# Altium project main_project.PrjPcb
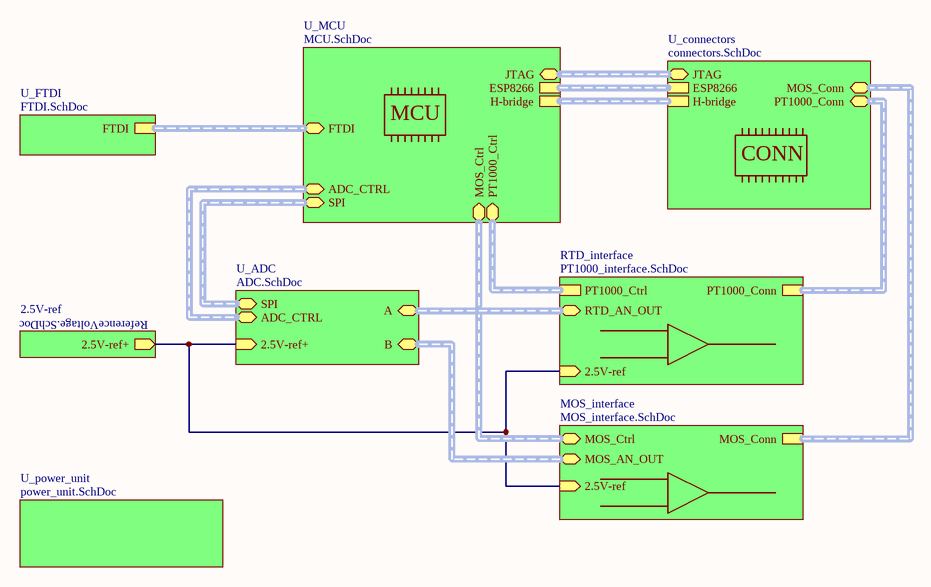
[diagram p0: Main.SchDoc]
9 sheets, 126 parts. Net scope: hierarchical (ports join the sheet entries above them; power ports are global).
Board files: main_fv.PcbDoc, PCB2.PcbDoc
Sheets:
  Main.SchDoc
    U_connectors = connectors.SchDoc
    U_MCU = MCU.SchDoc
    MOS_interface = MOS_interface.SchDoc
    RTD_interface = PT1000_interface.SchDoc
    U_power_unit = power_unit.SchDoc
    U_FTDI = FTDI.SchDoc
    U_ADC = ADC.SchDoc
    2.5V-ref = ReferenceVoltage.SchDoc

## Sheet Main.SchDoc: Top level scheme of Total Ionizing Dose meter (TIDm)
size A4; Date: 30.05.2015; Author: G. Gajoch, M. Gumiela; DocumentNumber: 1; SheetNumber: 1; SheetTotal: 9; Model: EM1; PageSetup: Record=PageOptions|CenterHorizontal=True|CenterVertical=True|PrintScale=0.52|XCorrection=1.00|YCorrection=1.00|PrintKind=1|BorderSize=5000000|LeftOffset=0|BottomOffset=0|Orientation=2|PaperLength=4200|PaperWidth=2970|Scale=100|PaperSource=7|PrintQuality=600|MediaType=1|DitherType=10|PaperKind=A3|PrintScaleMode=1

### Sub-sheets
2.5V-ref = ReferenceVoltage.SchDoc: 2.5V-ref+ (out)
MOS_interface = MOS_interface.SchDoc: MOS_Conn (harness MUX_Conn), MOS_AN_OUT (harness ADC_IN), 2.5V-ref (in), MOS_Ctrl (harness MUX_Ctrl)
RTD_interface = PT1000_interface.SchDoc: PT1000_Ctrl (harness MUX_Ctrl), PT1000_Conn (harness MUX_Conn), 2.5V-ref (in), RTD_AN_OUT (harness ADC_IN)
U_ADC = ADC.SchDoc: A (harness ADC_IN), B (harness ADC_IN), ADC_CTRL (harness ADC_CTRL), 2.5V-ref+ (in), SPI (harness SPI)
U_connectors = connectors.SchDoc: ESP8266 (harness ESP8266), H-bridge (harness H-Bridge), PT1000_Conn (harness MUX_Conn), MOS_Conn (harness MUX_Conn), JTAG (harness JTAG)
U_FTDI = FTDI.SchDoc: FTDI (harness FTDI)
U_MCU = MCU.SchDoc: ESP8266 (harness ESP8266), H-bridge (harness H-Bridge), JTAG (harness JTAG), FTDI (harness FTDI), ADC_CTRL (harness ADC_CTRL), SPI (harness SPI), PT1000_Ctrl (harness MUX_Ctrl), MOS_Ctrl
U_power_unit = power_unit.SchDoc: no entries

### Nets
2.5V-ref: sheet MOS_interface/2.5V-ref, sheet RTD_interface/2.5V-ref, sheet U_ADC/2.5V-ref+, sheet 2.5V-ref/2.5V-ref+

### Buses and harness runs
harness sheet MOS_interface/MOS_AN_OUT = sheet U_ADC/B
harness sheet MOS_interface/MOS_Conn = sheet U_connectors/MOS_Conn
harness sheet MOS_interface/MOS_Ctrl = sheet U_MCU/MOS_Ctrl
harness sheet RTD_interface/PT1000_Conn = sheet U_connectors/PT1000_Conn
harness sheet RTD_interface/PT1000_Ctrl = sheet U_MCU/PT1000_Ctrl
harness sheet RTD_interface/RTD_AN_OUT = sheet U_ADC/A
harness sheet U_ADC/ADC_CTRL = sheet U_MCU/ADC_CTRL
harness sheet U_ADC/SPI = sheet U_MCU/SPI
harness sheet U_connectors/ESP8266 = sheet U_MCU/ESP8266
harness sheet U_connectors/H-bridge = sheet U_MCU/H-bridge
harness sheet U_connectors/JTAG = sheet U_MCU/JTAG
harness sheet U_FTDI/FTDI = sheet U_MCU/FTDI

### Notes on the sheet
- MCU
- CONN
- Title:
- Sheet:
- of
- Author:
- Model:
- Document Number:
- Checked by:
- Iss-Rev:
- Approved by:
- Date:
- File name:

## Sheet connectors.SchDoc: Connectors
size A4; Date: 30.05.2015; Author: Michał Gumiela; DocumentNumber: 8; SheetNumber: 8; SheetTotal: 9; Model: EM1; PageSetup: Record=PageOptions|CenterHorizontal=True|CenterVertical=True|PrintScale=0.52|XCorrection=1.00|YCorrection=1.00|PrintKind=1|BorderSize=5000000|LeftOffset=0|BottomOffset=0|Orientation=2|PaperLength=4200|PaperWidth=2970|Scale=100|PaperSource=7|PrintQuality=600|MediaType=1|DitherType=10|PaperKind=A3|PrintScaleMode=1
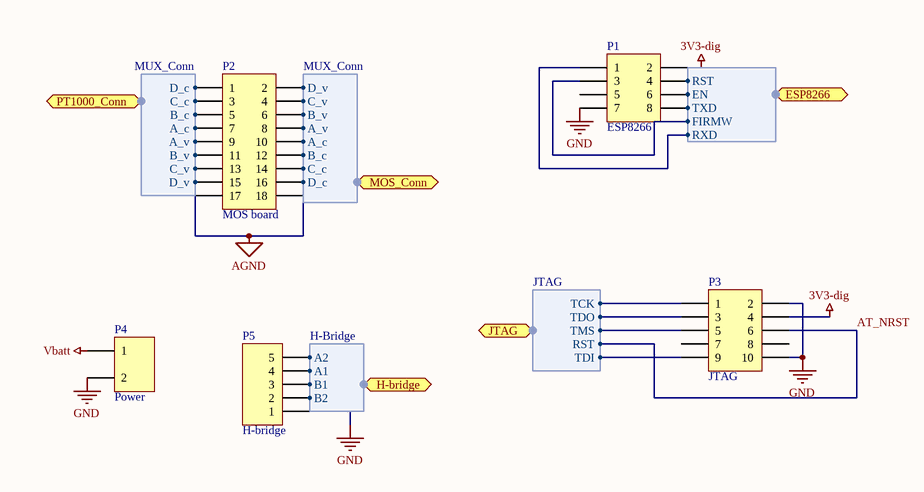
[diagram p1: connectors.SchDoc]

### Parts
P1  ESP8266  [Header 2x4]
P2  MOS board  [Header 2x9]
P3  JTAG  [Header 2x5]
P4  Power  [Header 1x3]
P5  H-bridge  [Header 1x5]

### Ports
ESP8266 (harness ESP8266), H-bridge (harness H-Bridge), JTAG (harness JTAG), MOS_Conn (harness MUX_Conn), PT1000_Conn (harness MUX_Conn)

### Harnesses
ESP8266: TXD, RXD, EN, RST, FIRMW
H-Bridge: A1, A2, B1, B2
MUX_Conn: A_c, B_c, C_c, D_c, A_v, B_v, C_v, D_v
JTAG: TCK, TMS, TDO, TDI, RST

### Nets
3V3-dig: P1.2 P3.4
AGND: P2.17 P2.18
GND: P1.7 P3.2 P3.10 P4.3(2) P5.1
Vbatt: P4.1
AT_NRST: P3.6 ; port JTAG.RST
NetP1_1: P1.1 ; port ESP8266.RXD
NetP1_3: P1.3 ; port ESP8266.FIRMW
NetP1_4: P1.4 ; port ESP8266.RST
NetP1_6: P1.6 ; port ESP8266.EN
NetP1_8: P1.8 ; port ESP8266.TXD
NetP2_1: P2.1 ; port PT1000_Conn.D_c
NetP2_2: P2.2 ; port MOS_Conn.D_v
NetP2_3: P2.3 ; port PT1000_Conn.C_c
NetP2_4: P2.4 ; port MOS_Conn.C_v
NetP2_5: P2.5 ; port PT1000_Conn.B_c
NetP2_6: P2.6 ; port MOS_Conn.B_v
NetP2_7: P2.7 ; port PT1000_Conn.A_c
NetP2_8: P2.8 ; port MOS_Conn.A_v
NetP2_9: P2.9 ; port PT1000_Conn.A_v
NetP2_10: P2.10 ; port MOS_Conn.A_c
NetP2_11: P2.11 ; port PT1000_Conn.B_v
NetP2_12: P2.12 ; port MOS_Conn.B_c
NetP2_13: P2.13 ; port PT1000_Conn.C_v
NetP2_14: P2.14 ; port MOS_Conn.C_c
NetP2_15: P2.15 ; port PT1000_Conn.D_v
NetP2_16: P2.16 ; port MOS_Conn.D_c
NetP3_1: P3.1 ; port JTAG.TCK
NetP3_3: P3.3 ; port JTAG.TDO
NetP3_5: P3.5 ; port JTAG.TMS
NetP3_9: P3.9 ; port JTAG.TDI
NetP5_2: P5.2 ; port H-bridge.B2
NetP5_3: P5.3 ; port H-bridge.B1
NetP5_4: P5.4 ; port H-bridge.A1
NetP5_5: P5.5 ; port H-bridge.A2

Not connected (* = marked no-connect by the designer): P1 5; P3 7 8; P4 2

### Notes on the sheet
- Title:
- Sheet:
- of
- Author:
- Model:
- Document Number:
- Checked by:
- Iss-Rev:
- Approved by:
- Date:
- File name:

### Library data of the parts
P1 = Header 4X2: Header, 4-Pin, Dual row; LatestRevisionDate: 17-Jul-2002; LatestRevisionNote: Re-released for DXP Platform.; Publisher: Altium Limited
P2 = Header 9X2: Header, 9-Pin, Dual row; LatestRevisionDate: 17-Jul-2002; LatestRevisionNote: Re-released for DXP Platform.; Publisher: Altium Limited
P3 = Header 5X2: Header, 5-Pin, Dual row; LatestRevisionDate: 17-Jul-2002; LatestRevisionNote: Re-released for DXP Platform.; Publisher: Altium Limited
P4 = Header 3: Header, 3-Pin; LatestRevisionDate: 17-Jul-2002; LatestRevisionNote: Re-released for DXP Platform.; Publisher: Altium Limited
P5 = Header 5: Header, 5-Pin; LatestRevisionDate: 17-Jul-2002; LatestRevisionNote: Re-released for DXP Platform.; Publisher: Altium Limited

## Sheet MCU.SchDoc: MCU board
size A4; Date: 30.05.2015; Author: Grzegorz Gajoch; Engineer: Grzegorz Gajoch; DocumentNumber: 4; SheetNumber: 4; SheetTotal: 9; Model: EM1; PageSetup: Record=PageOptions|CenterHorizontal=True|CenterVertical=True|PrintScale=0.52|XCorrection=1.00|YCorrection=1.00|PrintKind=1|BorderSize=5000000|LeftOffset=0|BottomOffset=0|Orientation=2|PaperLength=4200|PaperWidth=2970|Scale=100|PaperSource=7|PrintQuality=600|MediaType=1|DitherType=10|PaperKind=A3|PrintScaleMode=1
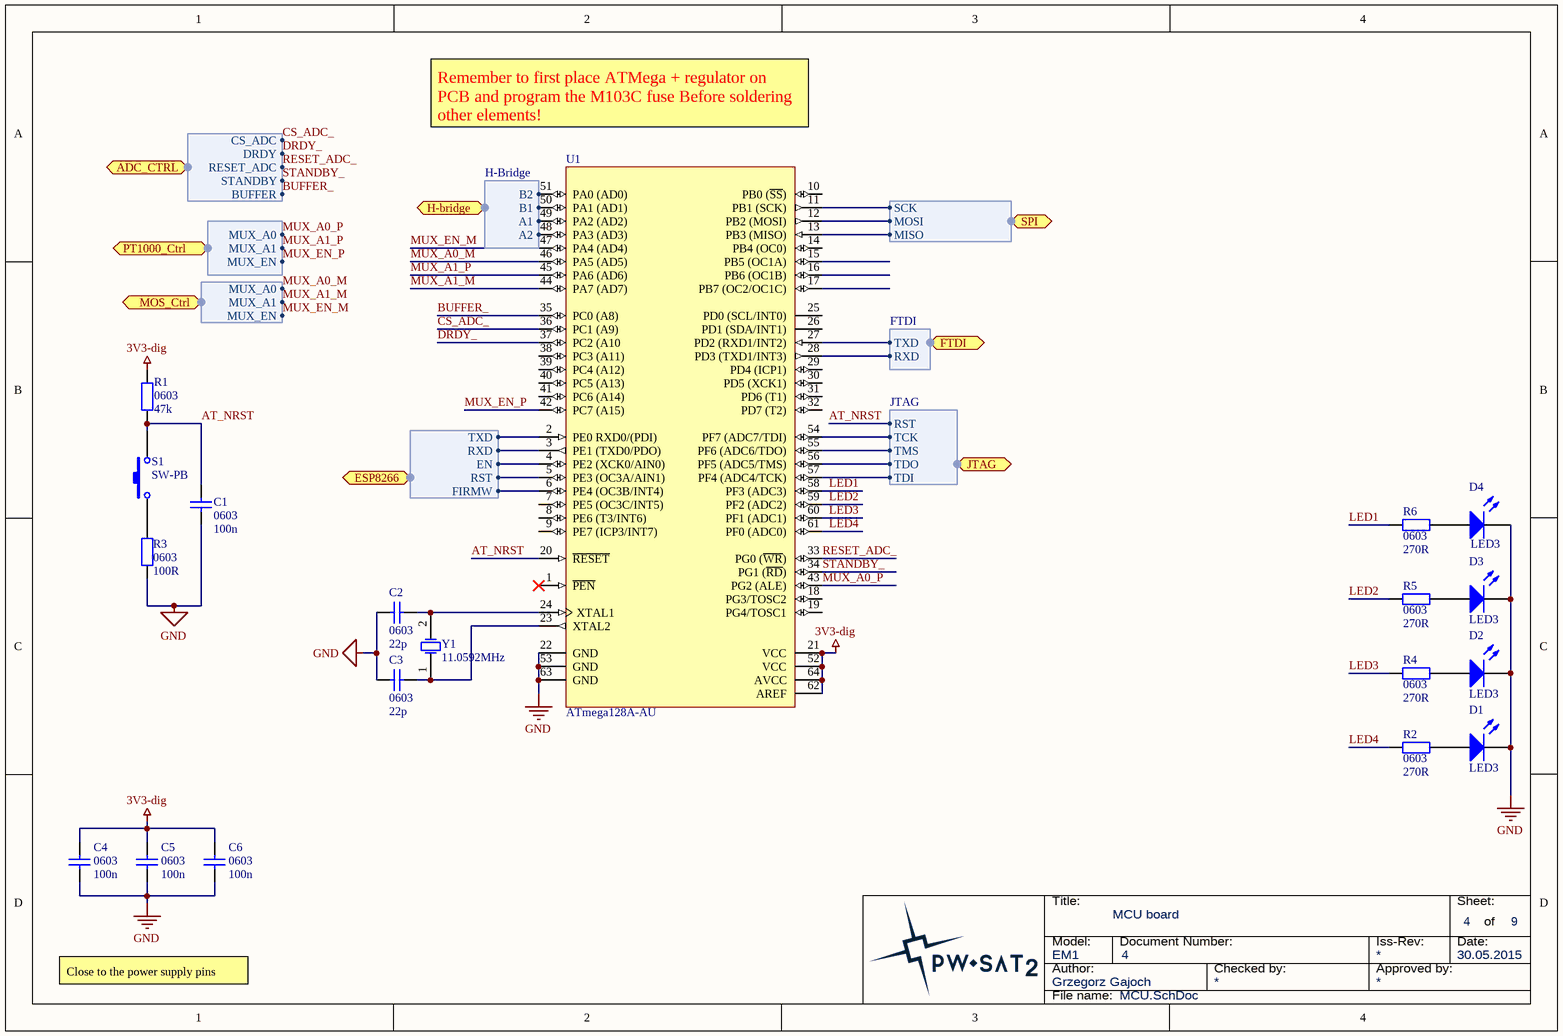
[diagram p2: MCU.SchDoc]

### Parts
C1  0603  value 100n  [SMD_Capacitor_0603]
C2  0603  value 22p  [SMD_Capacitor_0603]
C3  0603  value 22p  [SMD_Capacitor_0603]
C4  0603  value 100n  [SMD_Capacitor_0603]
C5  0603  value 100n  [SMD_Capacitor_0603]
C6  0603  value 100n  [SMD_Capacitor_0603]
D1  LED3  [LED 0805 RED]
D2  LED3  [LED 0805 GREEN]
D3  LED3  [LED 0805 Yellow]
D4  LED3  [LED 0805 Blue]
R1  0603  value 47k  [SMD_Resistor_0603]
R2  0603  value 270R  [SMD_Resistor_0603]
R3  0603  value 100R  [SMD_Resistor_0603]
R4  0603  value 270R  [SMD_Resistor_0603]
R5  0603  value 270R  [SMD_Resistor_0603]
R6  0603  value 270R  [SMD_Resistor_0603]
S1  SW-PB  [Tact Switch 3x6]
U1  ATmega128A-AU  [64A_M]
Y1  11.0592MHz  [Quartz]

### Ports
ADC_CTRL (harness ADC_CTRL), ESP8266 (harness ESP8266), FTDI (harness FTDI), H-bridge (harness H-Bridge), JTAG (harness JTAG), MOS_Ctrl (harness MUX_Ctrl), PT1000_Ctrl (harness MUX_Ctrl), SPI (harness SPI)

### Harnesses
JTAG: TCK, TMS, TDO, TDI, RST
MUX_Ctrl: MUX_A0, MUX_A1, MUX_EN
SPI: SCK, MOSI, MISO
FTDI: RXD, TXD
ADC_CTRL: CS_ADC, DRDY, RESET_ADC, STANDBY, BUFFER
ESP8266: TXD, RXD, EN, RST, FIRMW
H-Bridge: A1, A2, B1, B2

### Nets
3V3-dig: C4.2 C5.2 C6.2 R1.2 U1.21(VCC) U1.52(VCC) U1.62(AREF) U1.64(AVCC)
GND: C1.1 C2.1 C3.1 C4.1 C5.1 C6.1 D1.2(K) D2.2(K) D3.2(K) D4.2(K) R3.2 U1.22(GND) U1.53(GND) U1.63(GND)
AT_NRST: C1.2 R1.1 S1.2 U1.20(~{RESET}) ; port JTAG.RST
BUFFER_: U1.35(PC0_(A8)) ; port ADC_CTRL.BUFFER
CS_ADC_: U1.36(PC1_(A9)) ; port ADC_CTRL.CS_ADC
DRDY_: U1.37(PC2_(A10) ; port ADC_CTRL.DRDY
FTDI_RXD: U1.28(PD3_(TXD1/INT3)) ; port FTDI.RXD
FTDI_TXD: U1.27(PD2_(RXD1/INT2)) ; port FTDI.TXD
LED1: R6.2 U1.58(PF3_(ADC3))
LED2: R5.2 U1.59(PF2_(ADC2))
LED3: R4.2 U1.60(PF1_(ADC1))
LED4: R2.2 U1.61(PF0_(ADC0))
MUX_A0_M: U1.46(PA5_(AD5)) ; port MOS_Ctrl.MUX_A0
MUX_A0_P: U1.43(PG2_(ALE)) ; port PT1000_Ctrl.MUX_A0
MUX_A1_M: U1.44(PA7_(AD7)) ; port MOS_Ctrl.MUX_A1
MUX_A1_P: U1.45(PA6_(AD6)) ; port PT1000_Ctrl.MUX_A1
MUX_EN_M: U1.47(PA4_(AD4)) ; port MOS_Ctrl.MUX_EN
MUX_EN_P: U1.42(PC7_(A15)) ; port PT1000_Ctrl.MUX_EN
RESET_ADC_: U1.33(PG0_(~{WR})) ; port ADC_CTRL.RESET_ADC
STANDBY_: U1.34(PG1_(~{RD})) ; port ADC_CTRL.STANDBY
NetC2_2: C2.2 U1.24(XTAL1) Y1.2(OSC2)
NetC3_2: C3.2 U1.23(XTAL2) Y1.1(OSC1)
NetD1_1: D1.1(A) R2.1
NetD2_1: D2.1(A) R4.1
NetD3_1: D3.1(A) R5.1
NetD4_1: D4.1(A) R6.1
NetP1_1: U1.3(PE1_(TXD0/PDO)) ; port ESP8266.RXD
NetP1_3: U1.6(PE4_(OC3B/INT4)) ; port ESP8266.FIRMW
NetP1_4: U1.5(PE3_(OC3A/AIN1)) ; port ESP8266.RST
NetP1_6: U1.4(PE2_(XCK0/AIN0)) ; port ESP8266.EN
NetP1_8: U1.2(PE0_RXD0/(PDI)) ; port ESP8266.TXD
NetP3_1: U1.54(PF7_(ADC7/TDI)) ; port JTAG.TCK
NetP3_3: U1.56(PF5_(ADC5/TMS)) ; port JTAG.TDO
NetP3_5: U1.55(PF6_(ADC6/TDO)) ; port JTAG.TMS
NetP3_9: U1.57(PF4_(ADC4/TCK)) ; port JTAG.TDI
NetP5_2: U1.51(PA0_(AD0)) ; port H-bridge.B2
NetP5_3: U1.50(PA1_(AD1)) ; port H-bridge.B1
NetP5_4: U1.49(PA2_(AD2)) ; port H-bridge.A1
NetP5_5: U1.48(PA3_(AD3)) ; port H-bridge.A2
NetR3_1: R3.1 S1.1
NetU1_11: U1.11(PB1_(SCK)) ; port SPI.SCK
NetU1_12: U1.12(PB2_(MOSI)) ; port SPI.MOSI
NetU1_13: U1.13(PB3_(MISO)) ; port SPI.MISO

Not connected (* = marked no-connect by the designer): U1 1(~{PEN})* 7(PE5_(OC3C/INT5)) 8(PE6_(T3/INT6)) 9(PE7_(ICP3/INT7)) 10(PB0_(~{SS})) 14(PB4_(OC0)) 15(PB5_(OC1A)) 16(PB6_(OC1B)) 17(PB7_(OC2/OC1C)) 18(PG3/TOSC2) 19(PG4/TOSC1) 25(PD0_(SCL/INT0)) 26(PD1_(SDA/INT1)) 29(PD4_(ICP1)) 30(PD5_(XCK1)) 31(PD6_(T1)) 32(PD7_(T2)) 38(PC3_(A11)) 39(PC4_(A12)) 40(PC5_(A13)) 41(PC6_(A14))

### Notes on the sheet
- Remember to first place ATMega + regulator on PCB and program the M103C fuse Before soldering other elements!
- Close to the power supply pins
- Title:
- Sheet:
- of
- Author:
- Model:
- Document Number:
- Checked by:
- Iss-Rev:
- Approved by:
- Date:
- File name:

### Library data of the parts
C1 C4-C6 = Cap: Capacitor; Published: 8-Jun-2000; LatestRevisionDate: 17-Jul-2002; LatestRevisionNote: Re-released for DXP Platform.; PackageReference: RAD-0.3; Publisher: Altium Limited; PackageDescription: Radial Cap, Thru-Hole; 2 Leads; 0.3 in Pin Spacing
C2 C3 = Cap1: Capacitor; Published: 8-Jun-2000; LatestRevisionDate: 17-Jul-2002; LatestRevisionNote: Re-released for DXP Platform.; PackageReference: RAD-0.3; Publisher: Altium Limited; PackageDescription: Radial Cap, Thru-Hole; 2 Leads; 0.3 in Pin Spacing
D1-D4 = LED3: Typical BLUE SiC LED; Published: 8-Jun-2000; LatestRevisionDate: 17-Dec-2003; LatestRevisionNote: PCB Footprint replaced.; DatasheetVersion: 16-Apr-2002; PackageVersion: 16-Apr-2002; PackageReference: 3.5X2.8X1.9; Publisher: Altium Limited; PackageDescription: SM LED; 2 C-Bend Leads; Body 3.5 x 2.8 x 1.9 mm, inc leads (LxWxH typ)
R1-R6 = Res2: Resistor; Published: 8-Jun-2000; LatestRevisionDate: 17-Jul-2002; LatestRevisionNote: Re-released for DXP Platform.; PackageReference: AXIAL-0.4; Publisher: Altium Limited; PackageDescription: Axial Device, Thru-Hole; 2 Leads; 0.4 in Pin Spacing
S1 = SW-PB: Switch; Published: 24-Mar-1999; LatestRevisionDate: 17-Jul-2002; LatestRevisionNote: Re-released for DXP Platform.; PackageReference: SPST-2; Publisher: Altium Limited; PackageDescription: Switch; 2 Leads
U1 = ATmega128A-AU: 8-bit AVR Microcontroller, 2.7-5.5V, 16MHz, 128KB Flash, 4KB EEPROM, 4KB SRAM, 64-pin TQFP, Industrial Grade (-40°C to 85°C); DatasheetVersion: revH, Feb-2011; PackageVersion: revC, Oct-2010; PackageReference: 64A; PackageDescription: 64-Pin Plastic Thin Profile Quad Flat Pack, 14 x 14 x 1.0 mm Body, 0.8 mm Pitch (TQFP); Code_JEDEC: MS-026-AEB; ComponentLink1Description: Manufacturer URL; ComponentLink1URL: http://www.atmel.com/; ComponentLink2Description: ATmega128A Datasheet; ComponentLink2URL: http://www.atmel.com/dyn/resources/prod_documents/doc8151.pdf; ComponentLink3Description: ATmega128A Summary; ComponentLink3URL: http://www.atmel.com/dyn/resources/prod_documents/8151S.pdf
Y1 = XTAL: LF XTAL003519; Published: 8-Jun-2000; LatestRevisionDate: 17-Jul-2002; LatestRevisionNote: Re-released for DXP Platform.; PackageReference: R38; Publisher: Altium Limited; PackageDescription: Crystal, Thru-Hole; 2 Leads; Body 3.1 x 8.2 mm (Dia.xH)

## Sheet MOS_interface.SchDoc: P-MOSFET analog interface
size A3; Date: 30.05.2015; Author: Michał Gumiela; DocumentNumber: 6; SheetNumber: 6; SheetTotal: 9; Model: EM1; PageSetup: Record=PageOptions|CenterHorizontal=True|CenterVertical=True|PrintScale=0.52|XCorrection=1.00|YCorrection=1.00|PrintKind=1|BorderSize=5000000|LeftOffset=0|BottomOffset=0|Orientation=2|PaperLength=4200|PaperWidth=2970|Scale=100|PaperSource=7|PrintQuality=600|MediaType=1|DitherType=10|PaperKind=A3|PrintScaleMode=1
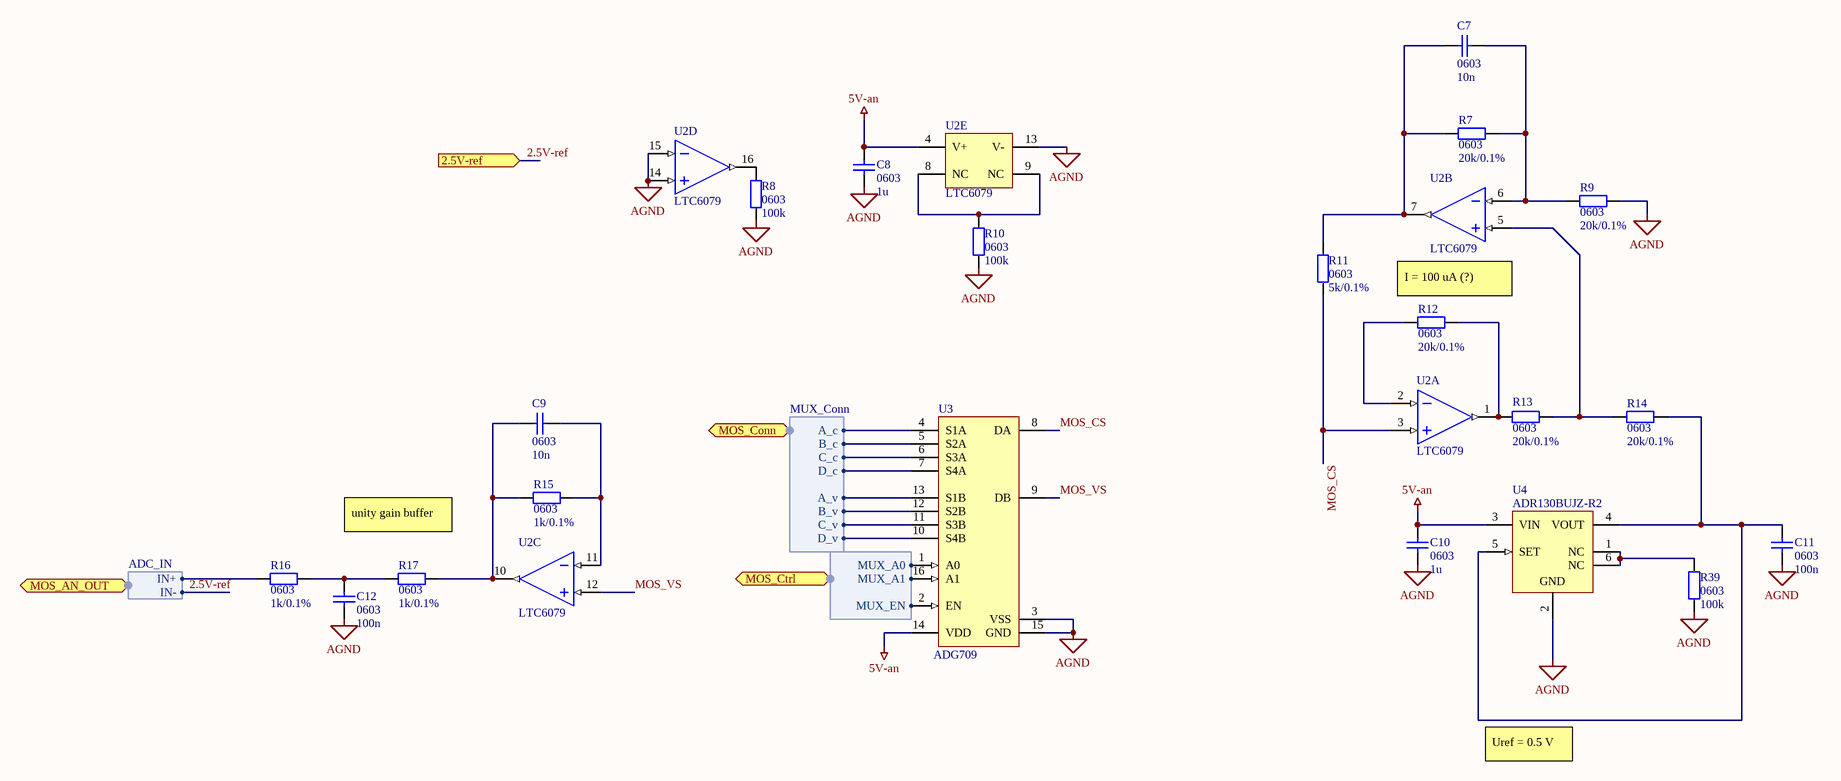
[diagram p3: MOS_interface.SchDoc]

### Parts
C7  0603  value 10n  [SMD_Capacitor_0603]
C8  0603  value 1u  [SMD_Capacitor_0603]
C9  0603  value 10n  [SMD_Capacitor_0603]
C10  0603  value 1u  [SMD_Capacitor_0603]
C11  0603  value 100n  [SMD_Capacitor_0603]
C12  0603  value 100n  [SMD_Capacitor_0603]
R7  0603  value 20k/0.1%  [SMD_Resistor_0603]
R8  0603  value 100k  [SMD_Resistor_0603]
R9  0603  value 20k/0.1%  [SMD_Resistor_0603]
R10  0603  value 100k  [SMD_Resistor_0603]
R11  0603  value 5k/0.1%  [SMD_Resistor_0603]
R12  0603  value 20k/0.1%  [SMD_Resistor_0603]
R13  0603  value 20k/0.1%  [SMD_Resistor_0603]
R14  0603  value 20k/0.1%  [SMD_Resistor_0603]
R15  0603  value 1k/0.1%  [SMD_Resistor_0603]
R16  0603  value 1k/0.1%  [SMD_Resistor_0603]
R17  0603  value 1k/0.1%  [SMD_Resistor_0603]
R39  0603  value 100k  [SMD_Resistor_0603]
U2  LTC6079  [SSOP-16]  (parts A,B,C,D,E of 5)
U3  ADG709  [TSSOP16]
U4  ADR130BUJZ-R2  [ADI-UJ-6_M]

### Ports
2.5V-ref (in), MOS_AN_OUT (harness ADC_IN), MOS_Conn (harness MUX_Conn), MOS_Ctrl (harness MUX_Ctrl)

### Harnesses
MUX_Ctrl: MUX_A0, MUX_A1, MUX_EN
MUX_Conn: A_c, B_c, C_c, D_c, A_v, B_v, C_v, D_v
ADC_IN: IN+, IN-

### Nets
5V-an: C8.2 C10.2 U2.4(V+) U3.14(VDD) U4.3(VIN)
AGND: C8.1 C10.1 C11.1 C12.1 R8.1 R9.1 R10.1 R39.1 U2.13(V-) U2.14(IN+_D) U2.15(IN-_D) U3.3(VSS) U3.15(GND) U4.2(GND)
2.5V-ref: port 2.5V-ref, port MOS_AN_OUT.IN-
MOS_CS: R11.1 U2.3(IN+_A) U3.8(DA)
MOS_VS: U2.12(IN+_C) U3.9(DB)
MUX_A0_M: U3.1(A0) ; port MOS_Ctrl.MUX_A0
MUX_A1_M: U3.16(A1) ; port MOS_Ctrl.MUX_A1
MUX_EN_M: U3.2(EN) ; port MOS_Ctrl.MUX_EN
NetC7_1: C7.1 R7.1 R9.2 U2.6(IN-_B)
NetC7_2: C7.2 R7.2 R11.2 U2.7(OUT_B)
NetC9_1: C9.1 R15.2 U2.11(IN-_C)
NetC9_2: C9.2 R15.1 R17.2 U2.10(OUT_C)
NetC11_2: C11.2 R14.1 U4.4(VOUT) U4.5(SET)
NetC12_2: C12.2 R16.2 R17.1
NetP2_2: U3.10(S4B) ; port MOS_Conn.D_v
NetP2_4: U3.11(S3B) ; port MOS_Conn.C_v
NetP2_6: U3.12(S2B) ; port MOS_Conn.B_v
NetP2_8: U3.13(S1B) ; port MOS_Conn.A_v
NetP2_10: U3.4(S1A) ; port MOS_Conn.A_c
NetP2_12: U3.5(S2A) ; port MOS_Conn.B_c
NetP2_14: U3.6(S3A) ; port MOS_Conn.C_c
NetP2_16: U3.7(S4A) ; port MOS_Conn.D_c
NetR8_2: R8.2 U2.16(OUT_D)
NetR10_2: R10.2 U2.8(NC) U2.9(NC)
NetR12_1: R12.1 R13.2 U2.1(OUT_A)
NetR12_2: R12.2 U2.2(IN-_A)
NetR13_1: R13.1 R14.2 U2.5(IN+_B)
NetR16_1: R16.1 ; port MOS_AN_OUT.IN+
NetR39_2: R39.2 U4.1(NC) U4.6(NC)

### Notes on the sheet
- I = 100 uA (?)
- unity gain buffer
- Uref = 0.5 V
- Title:
- Sheet:
- of
- Author:
- Model:
- Document Number:
- Checked by:
- Iss-Rev:
- Approved by:
- Date:
- File name:

### Library data of the parts
C7-C12 = Cap: Capacitor; Published: 8-Jun-2000; LatestRevisionDate: 17-Jul-2002; LatestRevisionNote: Re-released for DXP Platform.; PackageReference: RAD-0.3; Publisher: Altium Limited; PackageDescription: Radial Cap, Thru-Hole; 2 Leads; 0.3 in Pin Spacing
R7-R17 R39 = Res2: Resistor; Published: 8-Jun-2000; LatestRevisionDate: 17-Jul-2002; LatestRevisionNote: Re-released for DXP Platform.; PackageReference: AXIAL-0.4; Publisher: Altium Limited; PackageDescription: Axial Device, Thru-Hole; 2 Leads; 0.4 in Pin Spacing
U2 = LTC6079: Rail-to-rail, quad operational amplifier. Library compatible with LTC608X LTC607X op-amps; Manufacturer: Linear Technology; Value: LTC6079
U3 = ADG709: CMOS Analog 4-Channel Multiplexer; Manufacturer: Analog Devices; ManufacturerPartNumber: ADG709
U4 = ADR130BUJZ-R2: Precision Series Sub-Band Gap Voltage Reference, 1 V Output, 2 to 18 V Supply, Industrial, 6-pin SOT23 (UJ-6), Reel; Manufacturer: Analog Devices; Max V Supply (V): 18; Min V Supply (V): 2; Ref Out TC (ppm/C): 5; Vout: 0.5V, 1V; DatasheetVersion: Rev. B; PackageVersion: Dec-04; PackageReference: UJ-6; PackageDescription: 6-Pin Thin Small Outline Transistor Package, Body 2.9 x 1.6 mm, Pitch 0.95 mm; Supplier 1: Digi-Key; Supplier Part Number 1: ADR130BUJZ-R2TR-ND; Supplier 2: Digi-Key; Supplier Part Number 2: ADR130BUJZ-R2CT-ND; Supplier 3: Digi-Key; Supplier Part Number 3: ADR130BUJZ-R2DKR-ND; Supplier 4: Farnell; Supplier Part Number 4: 1699555; Supplier 5: Mouser; Supplier Part Number 5: 584-ADR130BUJZ-R2; Packing: Reel; Operating Temp Range: -40 to 125 degC; Mounting Technology: Surface Mount; Code_JEDEC: MO-193-AA; PartNumber: ADR130BUJZ-R2; ComponentLink1Description: Manufacturer URL; ComponentLink1URL: http://www.analog.com/en/index.html; ComponentLink2Description: Datasheet; ComponentLink2URL: http://www.analog.com/static/imported-files/data_sheets/ADR130.pdf; ComponentLink3Description: Package Specification; ComponentLink3URL: http://www.analog.com/static/imported-files/packages/PKG_PDF/TSOT(UJ)/UJ_6.pdf; ComponentLink4Description: URL Link1; ComponentLink4URL: Product URL:http://www.analog.com/en/special-linear-functions/voltage-references/adr130/products/product.html

## Sheet PT1000_interface.SchDoc: RTD analog interface
size A3; Date: 30.05.2015; Author: Michał Gumiela; DocumentNumber: 5; SheetNumber: 5; SheetTotal: 9; Model: EM1; PageSetup: Record=PageOptions|CenterHorizontal=True|CenterVertical=True|PrintScale=0.52|XCorrection=1.00|YCorrection=1.00|PrintKind=1|BorderSize=5000000|LeftOffset=0|BottomOffset=0|Orientation=2|PaperLength=4200|PaperWidth=2970|Scale=100|PaperSource=7|PrintQuality=600|MediaType=1|DitherType=10|PaperKind=A3|PrintScaleMode=1
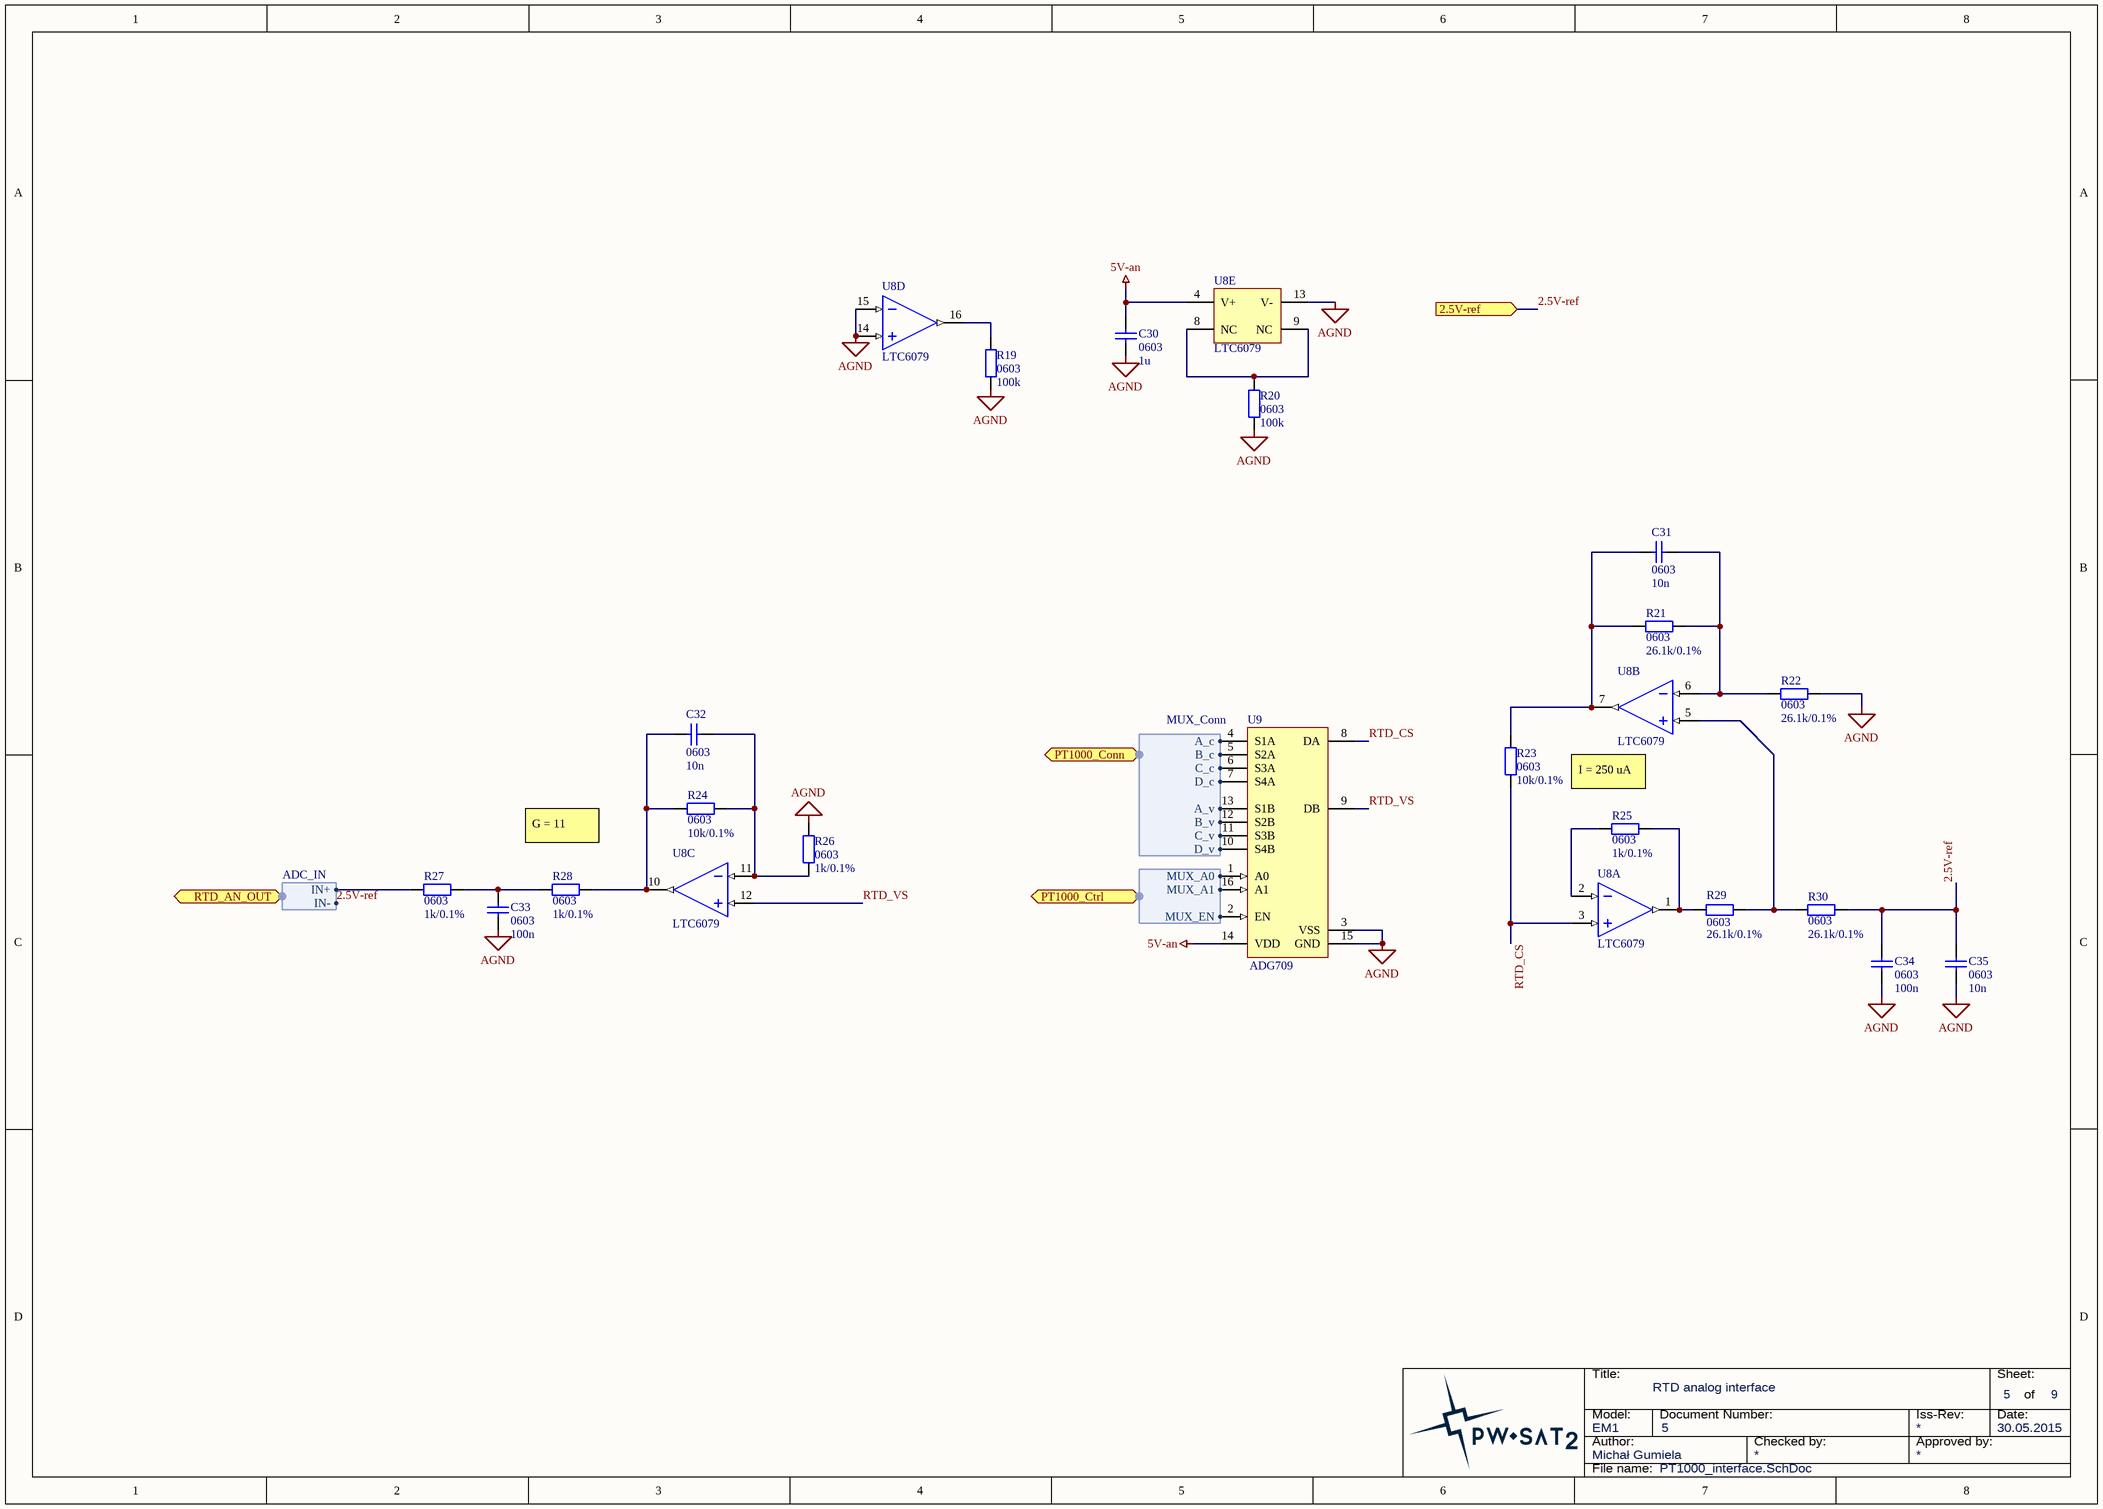
[diagram p4: PT1000_interface.SchDoc]

### Parts
C30  0603  value 1u  [SMD_Capacitor_0603]
C31  0603  value 10n  [SMD_Capacitor_0603]
C32  0603  value 10n  [SMD_Capacitor_0603]
C33  0603  value 100n  [SMD_Capacitor_0603]
C34  0603  value 100n  [SMD_Capacitor_0603]
C35  0603  value 10n  [SMD_Capacitor_0603]
R19  0603  value 100k  [SMD_Resistor_0603]
R20  0603  value 100k  [SMD_Resistor_0603]
R21  0603  value 26.1k/0.1%  [SMD_Resistor_0603]
R22  0603  value 26.1k/0.1%  [SMD_Resistor_0603]
R23  0603  value 10k/0.1%  [SMD_Resistor_0603]
R24  0603  value 10k/0.1%  [SMD_Resistor_0603]
R25  0603  value 1k/0.1%  [SMD_Resistor_0603]
R26  0603  value 1k/0.1%  [SMD_Resistor_0603]
R27  0603  value 1k/0.1%  [SMD_Resistor_0603]
R28  0603  value 1k/0.1%  [SMD_Resistor_0603]
R29  0603  value 26.1k/0.1%  [SMD_Resistor_0603]
R30  0603  value 26.1k/0.1%  [SMD_Resistor_0603]
U8  LTC6079  [SSOP-16]  (parts A,B,C,D,E of 5)
U9  ADG709  [TSSOP16]

### Ports
2.5V-ref (in), PT1000_Conn (harness MUX_Conn), PT1000_Ctrl (harness MUX_Ctrl), RTD_AN_OUT (harness ADC_IN)

### Harnesses
MUX_Ctrl: MUX_A0, MUX_A1, MUX_EN
MUX_Conn: A_c, B_c, C_c, D_c, A_v, B_v, C_v, D_v
ADC_IN: IN+, IN-

### Nets
5V-an: C30.2 U8.4(V+) U9.14(VDD)
AGND: C30.1 C33.1 C34.1 C35.1 R19.1 R20.1 R22.1 R26.1 U8.13(V-) U8.14(IN+_D) U8.15(IN-_D) U9.3(VSS) U9.15(GND)
2.5V-ref: C34.2 C35.2 R30.1 ; port 2.5V-ref, port RTD_AN_OUT.IN-
MUX_A0_P: U9.1(A0) ; port PT1000_Ctrl.MUX_A0
MUX_A1_P: U9.16(A1) ; port PT1000_Ctrl.MUX_A1
MUX_EN_P: U9.2(EN) ; port PT1000_Ctrl.MUX_EN
RTD_CS: R23.1 U8.3(IN+_A) U9.8(DA)
RTD_VS: U8.12(IN+_C) U9.9(DB)
NetC31_1: C31.1 R21.1 R22.2 U8.6(IN-_B)
NetC31_2: C31.2 R21.2 R23.2 U8.7(OUT_B)
NetC32_1: C32.1 R24.1 R26.2 U8.11(IN-_C)
NetC32_2: C32.2 R24.2 R28.2 U8.10(OUT_C)
NetC33_2: C33.2 R27.2 R28.1
NetP2_1: U9.7(S4A) ; port PT1000_Conn.D_c
NetP2_3: U9.6(S3A) ; port PT1000_Conn.C_c
NetP2_5: U9.5(S2A) ; port PT1000_Conn.B_c
NetP2_7: U9.4(S1A) ; port PT1000_Conn.A_c
NetP2_9: U9.13(S1B) ; port PT1000_Conn.A_v
NetP2_11: U9.12(S2B) ; port PT1000_Conn.B_v
NetP2_13: U9.11(S3B) ; port PT1000_Conn.C_v
NetP2_15: U9.10(S4B) ; port PT1000_Conn.D_v
NetR19_2: R19.2 U8.16(OUT_D)
NetR20_2: R20.2 U8.8(NC) U8.9(NC)
NetR25_1: R25.1 U8.2(IN-_A)
NetR25_2: R25.2 R29.2 U8.1(OUT_A)
NetR27_1: R27.1 ; port RTD_AN_OUT.IN+
NetR29_1: R29.1 R30.2 U8.5(IN+_B)

### Notes on the sheet
- I = 250 uA
- G = 11
- Title:
- Sheet:
- of
- Author:
- Model:
- Document Number:
- Checked by:
- Iss-Rev:
- Approved by:
- Date:
- File name:

### Library data of the parts
C30-C35 = Cap: Capacitor; Published: 8-Jun-2000; LatestRevisionDate: 17-Jul-2002; LatestRevisionNote: Re-released for DXP Platform.; PackageReference: RAD-0.3; Publisher: Altium Limited; PackageDescription: Radial Cap, Thru-Hole; 2 Leads; 0.3 in Pin Spacing
R19-R30 = Res2: Resistor; Published: 8-Jun-2000; LatestRevisionDate: 17-Jul-2002; LatestRevisionNote: Re-released for DXP Platform.; PackageReference: AXIAL-0.4; Publisher: Altium Limited; PackageDescription: Axial Device, Thru-Hole; 2 Leads; 0.4 in Pin Spacing
U8 = LTC6079: as U2 on sheet MOS_interface; Value: LTC6079
U9 = ADG709: as U3 on sheet MOS_interface; ManufacturerPartNumber: ADG709

## Sheet power_unit.SchDoc: Power filtering circuit
size A4; Date: 30.05.2015; Author: Grzegorz Gajoch; DocumentNumber: 2; SheetNumber: 2; SheetTotal: 9; Model: EM1; PageSetup: Record=PageOptions|CenterHorizontal=True|CenterVertical=True|PrintScale=0.52|XCorrection=1.00|YCorrection=1.00|PrintKind=1|BorderSize=5000000|LeftOffset=0|BottomOffset=0|Orientation=2|PaperLength=4200|PaperWidth=2970|Scale=100|PaperSource=7|PrintQuality=600|MediaType=1|DitherType=10|PaperKind=A3|PrintScaleMode=1
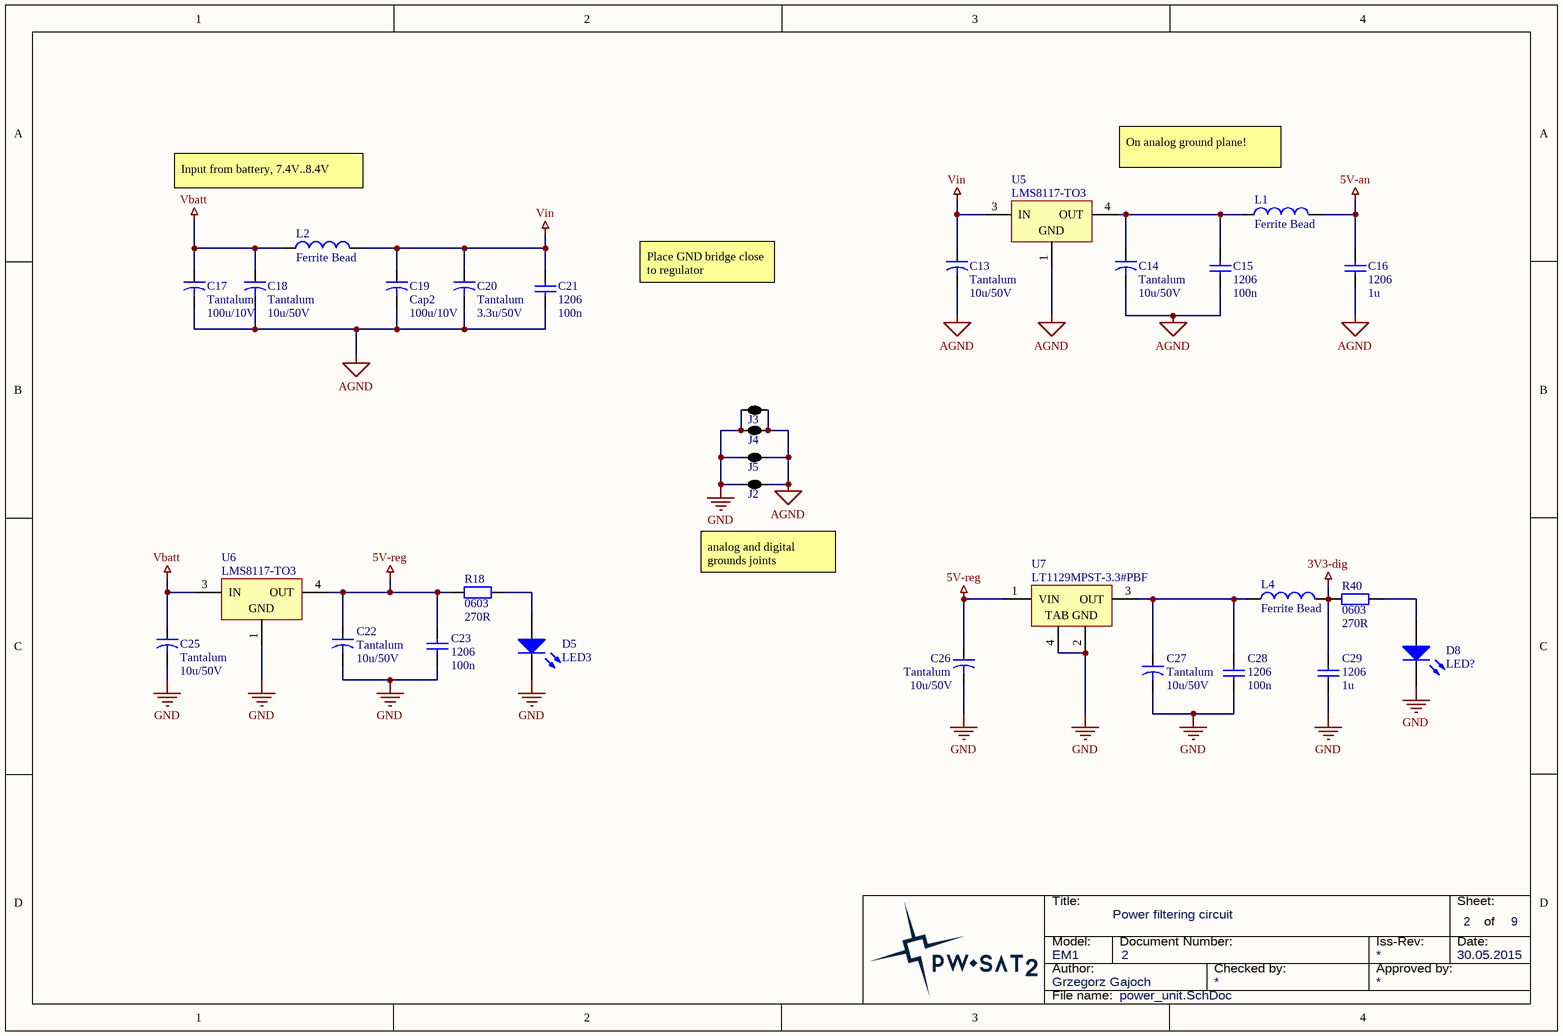
[diagram p5: power_unit.SchDoc]

### Parts
C13  Tantalum  value 10u/50V  [Tantalum_cap_D]
C14  Tantalum  value 10u/50V  [Tantalum_cap_D]
C15  1206  value 100n  [SMD_Capacitor_1206]
C16  1206  value 1u  [SMD_Capacitor_1206]
C17  Tantalum  value 100u/10V  [Tantalum_cap_D]
C18  Tantalum  value 10u/50V  [Tantalum_cap_D]
C19  Cap2  value 100u/10V  [Tantalum_cap_D]
C20  Tantalum  value 3.3u/50V  [Tantalum_cap_D]
C21  1206  value 100n  [SMD_Capacitor_1206]
C22  Tantalum  value 10u/50V  [Tantalum_cap_D]
C23  1206  value 100n  [SMD_Capacitor_1206]
C25  Tantalum  value 10u/50V  [Tantalum_cap_D]
C26  Tantalum  value 10u/50V  [Tantalum_cap_D]
C27  Tantalum  value 10u/50V  [Tantalum_cap_D]
C28  1206  value 100n  [SMD_Capacitor_1206]
C29  1206  value 1u  [SMD_Capacitor_1206]
D5  LED3  [LED 0805 RED]
D8  LED?  [LED 0805 RED]
J2  2 way net tie junction  [2way_MP]  (value not drawn)  (net tie, no BOM)
J3  2 way net tie junction  [2way_MP]  (value not drawn)  (net tie, no BOM)
J4  2 way net tie junction  [2way_MP]  (value not drawn)  (net tie, no BOM)
J5  2 way net tie junction  [2way_MP]  (value not drawn)  (net tie, no BOM)
L1  Ferrite Bead  [Ferrite 1206]
L2  Ferrite Bead  [Ferrite 1206]
L4  Ferrite Bead  [Ferrite 1206]
R18  0603  value 270R  [SMD_Resistor_0603]
R40  0603  value 270R  [SMD_Resistor_0603]
U5  LMS8117-TO3  [TD03B_M]
U6  LMS8117-TO3  [TD03B_M]
U7  LT1129MPST-3.3#PBF  [LT-ST-3-SOT-223_N]

### Nets
3V3-dig: C29.2 L4.2 R40.2
5V-an: C16.2 L1.2
5V-reg: C22.1 C23.2 C26.1 R18.2 U6.4(OUT) U7.1(VIN)
AGND: C13.2 C14.2 C15.1 C16.1 C17.2 C18.2 C19.2 C20.2 C21.1 J2.2 J3.2 J4.2 J5.2 U5.1(GND)
GND: C22.2 C23.1 C25.2 C26.2 C27.2 C28.1 C29.1 D5.2(K) D8.2(K) J2.1 J3.1 J4.1 J5.1 U6.1(GND) U7.2(GND) U7.4(TAB)
Vbatt: C17.1 C18.1 C25.1 L2.1 U6.3(IN)
Vin: C13.1 C19.1 C20.1 C21.2 L2.2 U5.3(IN)
NetC14_1: C14.1 C15.2 L1.1 U5.4(OUT)
NetC27_1: C27.1 C28.2 L4.1 U7.3(OUT)
NetD5_1: D5.1(A) R18.1
NetD8_1: D8.1(A) R40.1

### Notes on the sheet
- On analog ground plane!
- Input from battery, 7.4V..8.4V
- Place GND bridge close to regulator
- analog and digital grounds joints
- Title:
- Sheet:
- of
- Author:
- Model:
- Document Number:
- Checked by:
- Iss-Rev:
- Approved by:
- Date:
- File name:

### Library data of the parts
C13 C14 C17-C20 C22 C25-C27 = Cap2: Capacitor; Published: 23-Sep-2002; PackageReference: CAPR5-4X5; Publisher: Altium Limited; PackageDescription: Capacitor; 2 Leads
C15 C16 C21 C23 C28 C29 = Cap: Capacitor; Published: 8-Jun-2000; LatestRevisionDate: 17-Jul-2002; LatestRevisionNote: Re-released for DXP Platform.; PackageReference: RAD-0.3; Publisher: Altium Limited; PackageDescription: Radial Cap, Thru-Hole; 2 Leads; 0.3 in Pin Spacing
D5 D8 = LED3: Typical BLUE SiC LED; Published: 8-Jun-2000; LatestRevisionDate: 17-Dec-2003; LatestRevisionNote: PCB Footprint replaced.; DatasheetVersion: 16-Apr-2002; PackageVersion: 16-Apr-2002; PackageReference: 3.5X2.8X1.9; Publisher: Altium Limited; PackageDescription: SM LED; 2 C-Bend Leads; Body 3.5 x 2.8 x 1.9 mm, inc leads (LxWxH typ)
J2-J5 = 2way: ComponentLink1URL: http://www.edatools.cz/addons; ComponentLink1Description: Source; FootprintNote: LP=12mil, MP=40mil, HP=120mil
L1 L2 L4 = Inductor: Code_IEC: 1005; Published: 8-Jun-2000; LatestRevisionDate: 29-May-2009; LatestRevisionNote: IPC-7351 Footprint Added.; PackageReference: 0402-A; Publisher: Altium Limited; PackageDescription: Chip Inductor; Code_JEITA: 0402
R18 R40 = Res2: Resistor; Published: 8-Jun-2000; LatestRevisionDate: 17-Jul-2002; LatestRevisionNote: Re-released for DXP Platform.; PackageReference: AXIAL-0.4; Publisher: Altium Limited; PackageDescription: Axial Device, Thru-Hole; 2 Leads; 0.4 in Pin Spacing
U7 = LT1129MPST-3.3#PBF: Micropower Low Dropout Regulator with Shutdown, 4.15 to 30 V Vin, 3.3 V Vout, 3-pin SOT223 (ST-3), -55 to 125 degC, Pb-Free; Manufacturer: Linear Technology; Discrete Pass Element: no; Dropout Voltage(V): 0.45; Iout(mA): 700; Isupply(mA): 0.05; Number of Outputs: 1; Output Voltage: 3.3 V; PSRR(dB): 64; Shutdown Current(uA): 16; Vin Max(V): 30; Vin Min(V): 4.15; DatasheetVersion: Rev. F; PackageVersion: Jun-10; PackageReference: ST-3; PackageDescription: 3-Pin Plastic SOT-223, 3.505 x 6.505 mm Body, Pitch 2.3 mm; Supplier 1: Digi-Key; Supplier Part Number 1: LT1129MPST-3.3#PBF-ND; RoHS: TRUE; Mounting Technology: Surface Mount; PartNumber: LT1129MPST-3.3#PBF; ComponentLink1Description: Manufacturer URL; ComponentLink1URL: http://www.linear.com/; ComponentLink2Description: Datasheet; ComponentLink2URL: http://cds.linear.com/docs/en/datasheet/112935ff.pdf; ComponentLink3Description: Package Specification; ComponentLink3URL: http://cds.linear.com/docs/en/packaging/SOT_3_05-08-1630.pdf

## Sheet FTDI.SchDoc: FTDI
size A4; Date: 30.05.2015; Author: G. Gajoch, M. Gumiela; DocumentNumber: 9; SheetNumber: 9; SheetTotal: 9; Model: EM1; PageSetup: Record=PageOptions|CenterHorizontal=True|CenterVertical=True|PrintScale=0.52|XCorrection=1.00|YCorrection=1.00|PrintKind=1|BorderSize=5000000|LeftOffset=0|BottomOffset=0|Orientation=2|PaperLength=4200|PaperWidth=2970|Scale=100|PaperSource=7|PrintQuality=600|MediaType=1|DitherType=10|PaperKind=A3|PrintScaleMode=1
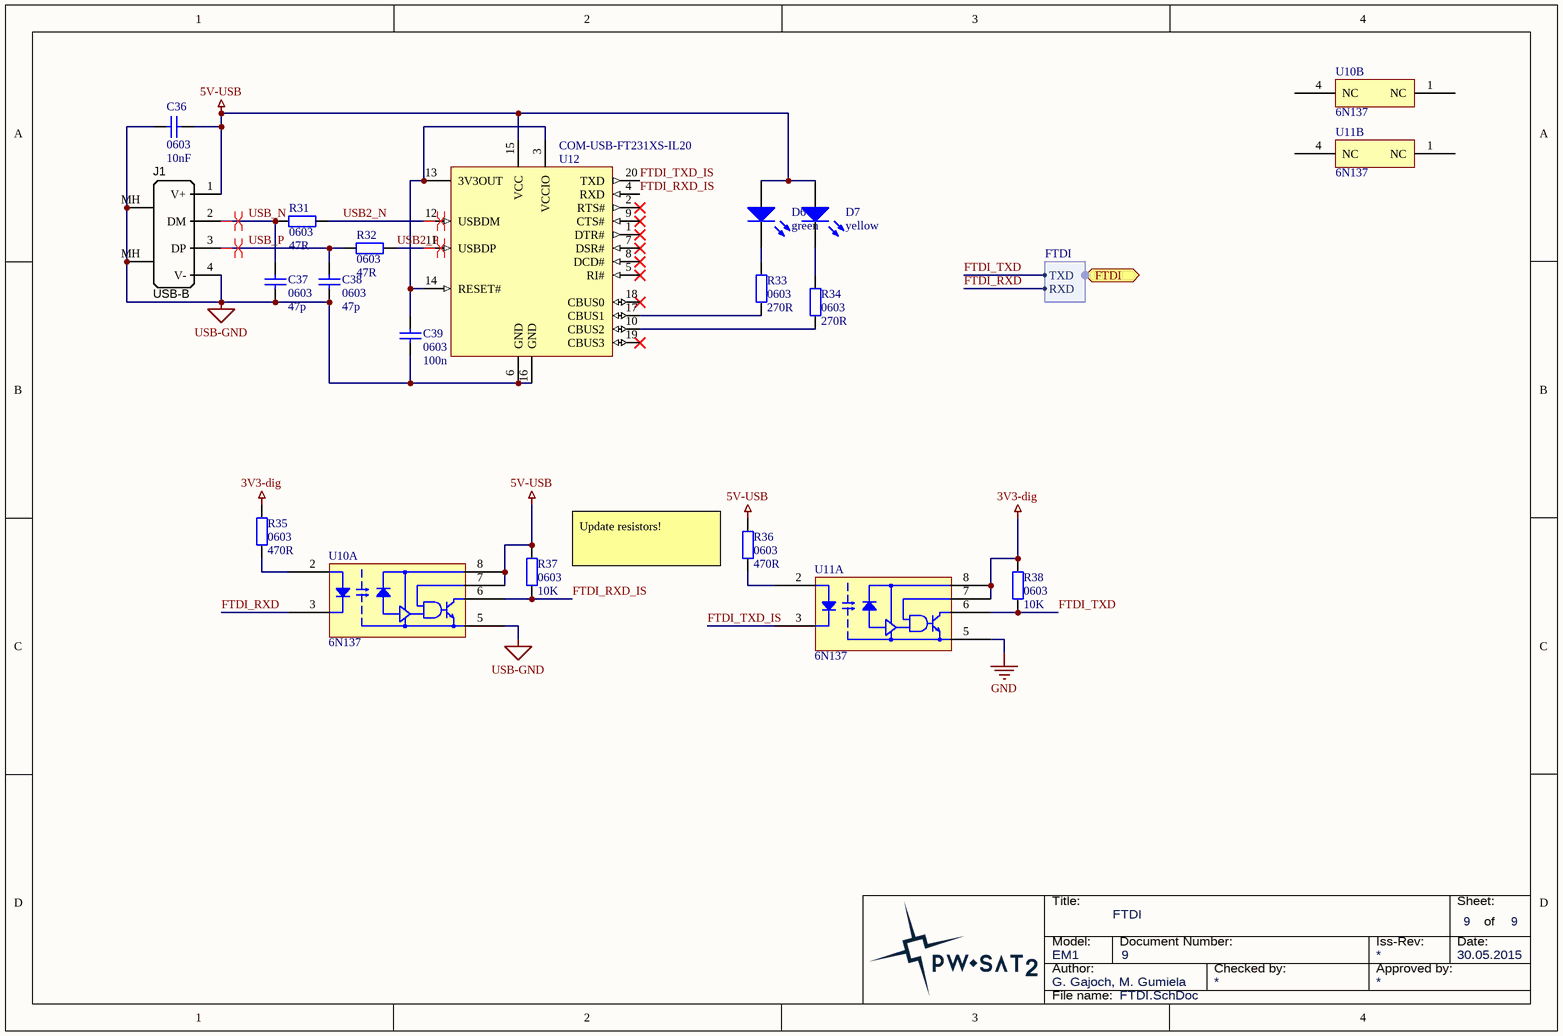
[diagram p6: FTDI.SchDoc]

### Parts
C36  0603  value 10nF  [SMD_Capacitor_0603]
C37  0603  value 47p  [SMD_Capacitor_0603]
C38  0603  value 47p  [SMD_Capacitor_0603]
C39  0603  value 100n  [SMD_Capacitor_0603]
D6  green  [LED 0805 GREEN]
D7  yellow  [LED 0805 Yellow]
J1  USB-B  [USB_TypeB_Tyco]
R31  0603  value 47R  [SMD_Resistor_0603]
R32  0603  value 47R  [SMD_Resistor_0603]
R33  0603  value 270R  [SMD_Resistor_0603]
R34  0603  value 270R  [SMD_Resistor_0603]
R35  0603  value 470R  [SMD_Resistor_0603]
R36  0603  value 470R  [SMD_Resistor_0603]
R37  0603  value 10K  [SMD_Resistor_0603]
R38  0603  value 10K  [SMD_Resistor_0603]
U10  6N137  [Surface Mount DIP 8-pin]  (parts A,B of 2)
U11  6N137  [Surface Mount DIP 8-pin]  (parts A,B of 2)
U12  COM-USB-FT231XS-IL20  [SSOP-20_L]

### Ports
FTDI (harness FTDI)

### Harnesses
FTDI: RXD, TXD

### Nets
3V3-dig: R35.2 R38.2 U11.7(Ve) U11.8(Vcc)
5V-USB: C36.1 D6.1(A) D7.1(A) J1.1(V+) R36.2 R37.2 U10.7(Ve) U10.8(Vcc) U12.15(VCC)
GND: U11.5(GND)
USB-GND: C36.2 C37.1 C38.1 C39.1 J1.4(V-) J1.MH(Shell) U10.5(GND) U12.6(GND) U12.16(GND)
FTDI_RXD: U10.3(-) ; port FTDI.RXD
FTDI_RXD_IS: R37.1 U10.6(Vo) U12.4(RXD)
FTDI_TXD: R38.1 U11.6(Vo) ; port FTDI.TXD
FTDI_TXD_IS: U11.3(-) U12.20(TXD)
USB2_N: R31.2 U12.12(USBDM)
USB2_P: R32.2 U12.11(USBDP)
USB_N: C37.2 J1.2(DM) R31.1
USB_P: C38.2 J1.3(DP) R32.1
NetC39_2: C39.2 U12.3(VCCIO) U12.13(3V3OUT) U12.14(RESET#)
NetD6_2: D6.2(K) R33.2
NetD7_2: D7.2(K) R34.2
NetR33_1: R33.1 U12.17(CBUS1)
NetR34_1: R34.1 U12.10(CBUS2)
NetR35_1: R35.1 U10.2(+)
NetR36_1: R36.1 U11.2(+)

Not connected (* = marked no-connect by the designer): U10 1(NC) 4(NC); U11 1(NC) 4(NC); U12 1(DTR#)* 2(RTS#)* 5(RI#)* 7(DSR#)* 8(DCD#)* 9(CTS#)* 18(CBUS0)* 19(CBUS3)*

### Layout directives
differential pair: USB2_N, USB2_P, USB_N, USB_P

### Notes on the sheet
- Update resistors!
- Title:
- Sheet:
- of
- Author:
- Model:
- Document Number:
- Checked by:
- Iss-Rev:
- Approved by:
- Date:
- File name:

### Library data of the parts
C36-C39 = Cap: Capacitor; Published: 8-Jun-2000; LatestRevisionDate: 17-Jul-2002; LatestRevisionNote: Re-released for DXP Platform.; PackageReference: RAD-0.3; Publisher: Altium Limited; PackageDescription: Radial Cap, Thru-Hole; 2 Leads; 0.3 in Pin Spacing
D6 D7 = LED2: Typical RED, GREEN, YELLOW, AMBER GaAs LED; Published: 8-Jun-2000; LatestRevisionDate: 17-Jul-2002; LatestRevisionNote: Re-released for DXP Platform.; PackageVersion: Feb-2002; PackageReference: 3.2X1.6X1.1; Publisher: Altium Limited; PackageDescription: SM LED; 2 Flat Leads
J1 = USB_TypeB: Connector THT Type B USB connector; Manufacturer Part Number 1: 292304-1; Manufacturer 1: TE Connectivity; Specifications: USB 2.0; SCDType: undef; Package / Case: R/A Type B; Supplier 1: Digi-Key; Connector Type: USB - B; Supplier Part Number 1: A31725-ND
R31-R38 = Res2: Resistor; Published: 8-Jun-2000; LatestRevisionDate: 17-Jul-2002; LatestRevisionNote: Re-released for DXP Platform.; PackageReference: AXIAL-0.4; Publisher: Altium Limited; PackageDescription: Axial Device, Thru-Hole; 2 Leads; 0.4 in Pin Spacing

## Sheet ADC.SchDoc: 24-bit Analog to Digital converter
size A4; Date: 30.05.2015; Author: Grzegorz Gajoch; DocumentNumber: 7; SheetNumber: 7; SheetTotal: 9; Model: EM1; PageSetup: Record=PageOptions|CenterHorizontal=True|CenterVertical=True|PrintScale=0.52|XCorrection=1.00|YCorrection=1.00|PrintKind=1|BorderSize=5000000|LeftOffset=0|BottomOffset=0|Orientation=2|PaperLength=4200|PaperWidth=2970|Scale=100|PaperSource=7|PrintQuality=600|MediaType=1|DitherType=10|PaperKind=A3|PrintScaleMode=1
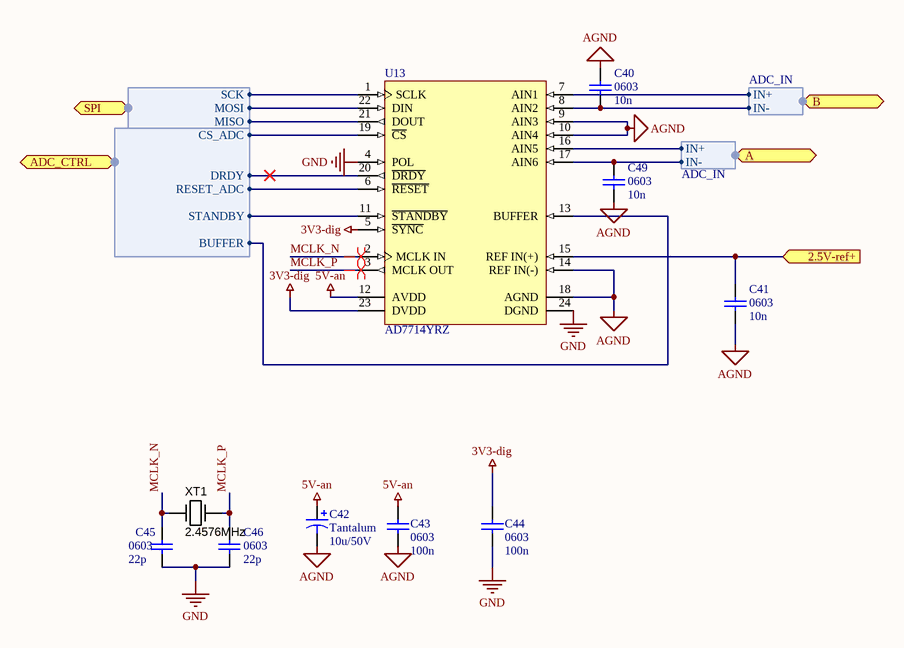
[diagram p7: ADC.SchDoc]

### Parts
C40  0603  value 10n  [SMD_Capacitor_0603]
C41  0603  value 10n  [SMD_Capacitor_0603]
C42  Tantalum  value 10u/50V  [Tantalum_cap_D]
C43  0603  value 100n  [SMD_Capacitor_0603]
C44  0603  value 100n  [SMD_Capacitor_0603]
C45  0603  value 22p  [SMD_Capacitor_0603]
C46  0603  value 22p  [SMD_Capacitor_0603]
C49  0603  value 10n  [SMD_Capacitor_0603]
U13  AD7714YRZ  [RW-24_M]
XT1  2.4576MHz  [HC49U]

### Ports
2.5V-ref+ (in), A (harness ADC_IN), ADC_CTRL (harness ADC_CTRL), B (harness ADC_IN), SPI (harness SPI)

### Harnesses
ADC_CTRL: CS_ADC, DRDY, RESET_ADC, STANDBY, BUFFER
SPI: SCK, MOSI, MISO
ADC_IN: IN+, IN-

### Nets
3V3-dig: C44.2 U13.5(~{SYNC}) U13.23(DVDD)
5V-an: C42.1 C43.2 U13.12(AVDD)
AGND: C40.2 C41.1 C42.2 C43.1 C49.1 U13.9(AIN3) U13.10(AIN4) U13.14(REF_IN(-)) U13.18(AGND)
GND: C44.1 C45.1 C46.1 U13.4(POL) U13.24(DGND)
2.5V-ref: C40.1 C41.2 C49.2 U13.8(AIN2) U13.15(REF_IN(+)) U13.17(AIN6) ; port 2.5V-ref+, port B.IN-, port A.IN-
BUFFER_: U13.13(BUFFER) ; port ADC_CTRL.BUFFER
CS_ADC_: U13.19(~{CS}) ; port ADC_CTRL.CS_ADC
DRDY_: U13.20(~{DRDY}) ; port ADC_CTRL.DRDY
MCLK_N: C45.2 U13.2(MCLK_IN) XT1.1(IN)
MCLK_P: C46.2 U13.3(MCLK_OUT) XT1.2(OUT)
RESET_ADC_: U13.6(~{RESET}) ; port ADC_CTRL.RESET_ADC
STANDBY_: U13.11(~{STANDBY}) ; port ADC_CTRL.STANDBY
NetR16_1: U13.7(AIN1) ; port B.IN+
NetR27_1: U13.16(AIN5) ; port A.IN+
NetU1_11: U13.1(SCLK) ; port SPI.SCK
NetU1_12: U13.22(DIN) ; port SPI.MOSI
NetU1_13: U13.21(DOUT) ; port SPI.MISO

### Layout directives
differential pair: MCLK_N, MCLK_P

### Notes on the sheet
- Title:
- Sheet:
- of
- Author:
- Model:
- Document Number:
- Checked by:
- Iss-Rev:
- Approved by:
- Date:
- File name:

### Library data of the parts
C40 C41 C43-C46 C49 = Cap1: Capacitor; Published: 8-Jun-2000; LatestRevisionDate: 17-Jul-2002; LatestRevisionNote: Re-released for DXP Platform.; PackageReference: RAD-0.3; Publisher: Altium Limited; PackageDescription: Radial Cap, Thru-Hole; 2 Leads; 0.3 in Pin Spacing
C42 = Cap Pol1: Polarized Capacitor (Radial); Published: 8-Jun-2000; LatestRevisionDate: 17-Jul-2002; LatestRevisionNote: Re-released for DXP Platform.; PackageReference: RB7.6-15; Publisher: Altium Limited; PackageDescription: Polarized Capacitor (Radial); 2 Leads
U13 = AD7714YRZ: 5 Channel 24-Bit Signal Conditioning Analog-to-Digital Converter with Serial, SPI Interface, 500 uA, CMOS, 3 V / 5 V, 1KSPS, -40 to +105 degC, RW-24, Pb-Free, Tube; Generic Part Number: AD7714; Manufacturer: Analog Devices; Resolution (Bits): 24; Channels: 5; Throughput Rate (SPS): 1K; Interface: Ser, SPI; DatasheetVersion: Rev.C; PackageVersion: 060706-A; PackageReference: RW-24; PackageDescription: 24-Lead Standard Small Outline Package [SOIC_W]; Supplier 1: Digi-Key; Supplier Part Number 1: AD7714YRZ-ND; Supplier 2: Farnell; Supplier Part Number 2: 1438858; Supplier 3: Newark; Supplier Part Number 3: 15P0854; Supplier 4: Newark; Supplier Part Number 4: 59K5335; Supplier 5: Mouser; Supplier Part Number 5: 584-AD7714YRZ; RoHS: Y; Packing: Tube; Mounting Technology: Surface Mount; Code_JEDEC: MS-013-AD; PartNumber: AD7714YRZ; ComponentLink1Description: Manufacturer URL; ComponentLink1URL: http://www.analog.com/en/index.html; ComponentLink2Description: Datasheet; ComponentLink2URL: http://www.analog.com/static/imported-files/data_sheets/AD7714.pdf; ComponentLink3Description: Package Specification; ComponentLink3URL: http://www.analog.com/static/imported-files/packages/33665150946139RW_24.pdf; ComponentLink4Description: Product URL; ComponentLink4URL: http://www.analog.com/en/analog-to-digital-converters/ad-converters/ad7714/products/product.html
XT1 = Crystal: AKER  C-2.4576-18-3050-X; Manufacturer 1: Citizen Finetech Miyota; Manufacturer Part Number 1: CMR309T-6.000MABJ-UT; Ratings: 6.00 MHz; Frequency: 6MHz; Frequency Stability: ±50ppm; Frequency Tolerance: ±30ppm; Load Capacitance: 18pF; Operating Mode: Fundamental; SCDType: spec; Package / Case: Cylindrical Can, Radial; Type: MHz Crystal; Operating Temperature: -10°C ~ 60°C; Mounting Type: Surface Mount; Size / Dimension: 0.118" Dia x 0.346" L (3.00mm x 8.80mm); Height: 0.122" (3.10mm); Supplier 1: Digi-Key; Supplier Part Number 1: 300-8348-1-ND; Tolerance: ±50ppm; ComponentLink1URL: http://media.digikey.com/pdf/Data%20Sheets/Citizen%20PDFs/CMR310T%20CMR309T.pdf; ComponentLink1Description: http://media.digikey.com/pdf/Data%20Sheets/Citizen%20PDFs/CMR310T%20CMR309T.pdf; Value: 2.4576MHz

## Sheet ReferenceVoltage.SchDoc: Precision, low drift, 2.5V Reference Voltage
size A4; Date: 30.05.2015; Author: G. Gajoch, M. Gumiela; DocumentNumber: 3; SheetNumber: 3; SheetTotal: 9; Model: EM1; PageSetup: Record=PageOptions|CenterHorizontal=True|CenterVertical=True|PrintScale=0.52|XCorrection=1.00|YCorrection=1.00|PrintKind=1|BorderSize=5000000|LeftOffset=0|BottomOffset=0|Orientation=2|PaperLength=4200|PaperWidth=2970|Scale=100|PaperSource=7|PrintQuality=600|MediaType=1|DitherType=10|PaperKind=A3|PrintScaleMode=1
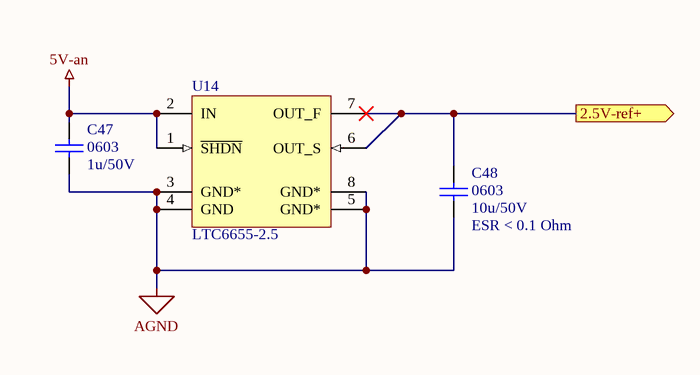
[diagram p8: ReferenceVoltage.SchDoc]

### Parts
C47  0603  value 1u/50V  [SMD_Capacitor_0603]
C48  ESR < 0.1 Ohm  value 10u/50V  [SMD_Capacitor_0603]
U14  LTC6655-2.5  [MSOP-8]

### Ports
2.5V-ref+ (out)

### Nets
5V-an: C47.2 U14.1(~{SHDN}) U14.2(IN)
AGND: C47.1 C48.1 U14.3(GND*) U14.4(GND) U14.5(GND*) U14.8(GND*)
2.5V-ref: C48.2 U14.6(OUT_S) U14.7(OUT_F) ; port 2.5V-ref+

### Notes on the sheet
- Title:
- Sheet:
- of
- Author:
- Model:
- Document Number:
- Checked by:
- Iss-Rev:
- Approved by:
- Date:
- File name:

### Library data of the parts
C47 C48 = Cap: Capacitor; Published: 8-Jun-2000; LatestRevisionDate: 17-Jul-2002; LatestRevisionNote: Re-released for DXP Platform.; PackageReference: RAD-0.3; Publisher: Altium Limited; PackageDescription: Radial Cap, Thru-Hole; 2 Leads; 0.3 in Pin Spacing
U14 = LTC6655-2.5: 0.25ppm Noise, Low Drift  Precision References; PartNumber: LTC6655-2.5; ComponentLink1Description: Manufacturer URL; ComponentLink1URL: http://www.linear.com/; ComponentLink2Description: Datasheet; ComponentLink2URL: http://cds.linear.com/docs/en/datasheet/6655fe.pdf

## Nets that join several sheets
3V3-dig: connectors (P1.2 P3.4), MCU (8 pins), power_unit (C29.2 L4.2 R40.2), FTDI (R35.2 R38.2 U11.7 U11.8), ADC (C44.2 U13.5 U13.23)
5V-an: MOS_interface (5 pins), PT1000_interface (C30.2 U8.4 U9.14), power_unit (C16.2 L1.2), ADC (C42.1 C43.2 U13.12), ReferenceVoltage (C47.2 U14.1 U14.2)
AGND: connectors (P2.17 P2.18), MOS_interface (14 pins), PT1000_interface (13 pins), power_unit (14 pins), ADC (9 pins), ReferenceVoltage (6 pins)
GND: connectors (5 pins), MCU (14 pins), power_unit (16 pins), FTDI (U11.5), ADC (5 pins)
Vbatt: connectors (P4.1), power_unit (5 pins)
2.5V-ref: PT1000_interface (C34.2 C35.2 R30.1), ADC (6 pins), ReferenceVoltage (C48.2 U14.6 U14.7)
AT_NRST: connectors (P3.6), MCU (C1.2 R1.1 S1.2 U1.20)
BUFFER_: MCU (U1.35), ADC (U13.13)
CS_ADC_: MCU (U1.36), ADC (U13.19)
DRDY_: MCU (U1.37), ADC (U13.20)
FTDI_RXD: MCU (U1.28), FTDI (U10.3)
FTDI_TXD: MCU (U1.27), FTDI (R38.1 U11.6)
MUX_A0_M: MCU (U1.46), MOS_interface (U3.1)
MUX_A0_P: MCU (U1.43), PT1000_interface (U9.1)
MUX_A1_M: MCU (U1.44), MOS_interface (U3.16)
MUX_A1_P: MCU (U1.45), PT1000_interface (U9.16)
MUX_EN_M: MCU (U1.47), MOS_interface (U3.2)
MUX_EN_P: MCU (U1.42), PT1000_interface (U9.2)
NetP1_1: connectors (P1.1), MCU (U1.3)
NetP1_3: connectors (P1.3), MCU (U1.6)
NetP1_4: connectors (P1.4), MCU (U1.5)
NetP1_6: connectors (P1.6), MCU (U1.4)
NetP1_8: connectors (P1.8), MCU (U1.2)
NetP2_1: connectors (P2.1), PT1000_interface (U9.7)
NetP2_2: connectors (P2.2), MOS_interface (U3.10)
NetP2_3: connectors (P2.3), PT1000_interface (U9.6)
NetP2_4: connectors (P2.4), MOS_interface (U3.11)
NetP2_5: connectors (P2.5), PT1000_interface (U9.5)
NetP2_6: connectors (P2.6), MOS_interface (U3.12)
NetP2_7: connectors (P2.7), PT1000_interface (U9.4)
NetP2_8: connectors (P2.8), MOS_interface (U3.13)
NetP2_9: connectors (P2.9), PT1000_interface (U9.13)
NetP2_10: connectors (P2.10), MOS_interface (U3.4)
NetP2_11: connectors (P2.11), PT1000_interface (U9.12)
NetP2_12: connectors (P2.12), MOS_interface (U3.5)
NetP2_13: connectors (P2.13), PT1000_interface (U9.11)
NetP2_14: connectors (P2.14), MOS_interface (U3.6)
NetP2_15: connectors (P2.15), PT1000_interface (U9.10)
NetP2_16: connectors (P2.16), MOS_interface (U3.7)
NetP3_1: connectors (P3.1), MCU (U1.54)
NetP3_3: connectors (P3.3), MCU (U1.56)
NetP3_5: connectors (P3.5), MCU (U1.55)
NetP3_9: connectors (P3.9), MCU (U1.57)
NetP5_2: connectors (P5.2), MCU (U1.51)
NetP5_3: connectors (P5.3), MCU (U1.50)
NetP5_4: connectors (P5.4), MCU (U1.49)
NetP5_5: connectors (P5.5), MCU (U1.48)
NetR16_1: MOS_interface (R16.1), ADC (U13.7)
NetR27_1: PT1000_interface (R27.1), ADC (U13.16)
NetU1_11: MCU (U1.11), ADC (U13.1)
NetU1_12: MCU (U1.12), ADC (U13.22)
NetU1_13: MCU (U1.13), ADC (U13.21)
RESET_ADC_: MCU (U1.33), ADC (U13.6)
STANDBY_: MCU (U1.34), ADC (U13.11)